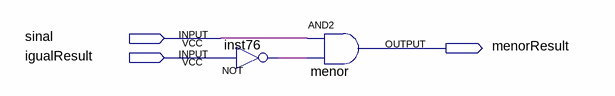
[diagram p0: schematic sheet]
// Quartus schematic Menor.bdf as structural Verilog: 2 symbols, 3 pins
module Menor (
  input  sinal,
  input  igualResult,
  output menorResult
);

  wire inst76_out;

  not inst76 (inst76_out, igualResult);
  and menor (menorResult, sinal, inst76_out);
endmodule
